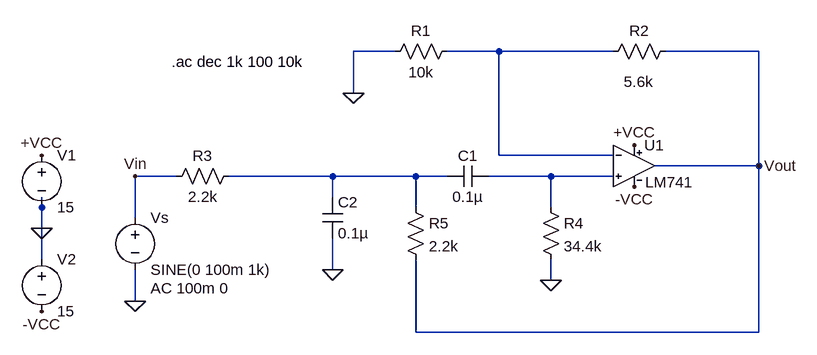
[diagram p0: schematic BandPassFilter.asc]
BandPassFilter.asc, the LTspice schematic file:
Version 4
SHEET 1 880 680
WIRE -144 -32 -208 -32
WIRE 16 -32 -64 -32
WIRE 192 -32 16 -32
WIRE 416 -32 272 -32
WIRE -208 32 -208 -32
WIRE 16 128 16 -32
WIRE 192 128 16 128
WIRE 416 144 416 -32
WIRE 416 144 256 144
WIRE -480 160 -544 160
WIRE -240 160 -400 160
WIRE -112 160 -240 160
WIRE -64 160 -112 160
WIRE 96 160 0 160
WIRE 192 160 96 160
WIRE -240 192 -240 160
WIRE -688 208 -688 192
WIRE -112 208 -112 160
WIRE 96 208 96 160
WIRE -544 224 -544 160
WIRE -688 240 -688 208
WIRE -688 288 -688 240
WIRE -240 304 -240 256
WIRE 96 320 96 288
WIRE -544 352 -544 304
WIRE -112 400 -112 288
WIRE 416 400 416 144
WIRE 416 400 -112 400
FLAG -208 32 0
FLAG 224 112 +VCC
FLAG 224 176 -VCC
FLAG -240 304 0
FLAG -544 352 0
FLAG 96 320 0
FLAG 416 144 Vout
FLAG -688 128 +VCC
FLAG -688 368 -VCC
FLAG -688 240 0
FLAG -544 160 Vin
SYMBOL LM741 224 80 R0
SYMATTR InstName U1
SYMBOL cap 0 144 R90
WINDOW 0 0 32 VBottom 2
WINDOW 3 32 32 VTop 2
SYMATTR InstName C1
SYMATTR Value 0.1µ
SYMBOL res -48 -48 R90
WINDOW 0 0 56 VBottom 2
WINDOW 3 32 56 VTop 2
SYMATTR InstName R1
SYMATTR Value 10k
SYMBOL res 288 -48 R90
WINDOW 0 0 56 VBottom 2
WINDOW 3 47 57 VTop 2
SYMATTR InstName R2
SYMATTR Value 5.6k
SYMBOL cap -256 192 R0
SYMATTR InstName C2
SYMATTR Value 0.1µ
SYMBOL res -384 144 R90
WINDOW 0 0 56 VBottom 2
WINDOW 3 32 56 VTop 2
SYMATTR InstName R3
SYMATTR Value 2.2k
SYMBOL voltage -544 208 R0
WINDOW 123 24 124 Left 2
WINDOW 39 0 0 Left 0
SYMATTR Value2 AC 100m 0
SYMATTR InstName Vs
SYMATTR Value SINE(0 100m 1k)
SYMBOL res 80 192 R0
WINDOW 0 36 40 Left 2
WINDOW 3 36 76 Left 2
SYMATTR InstName R4
SYMATTR Value 34.4k
SYMBOL res -128 192 R0
WINDOW 0 36 40 Left 2
WINDOW 3 36 76 Left 2
SYMATTR InstName R5
SYMATTR Value 2.2k
SYMBOL voltage -688 272 R0
WINDOW 123 0 0 Left 0
WINDOW 39 0 0 Left 0
SYMATTR InstName V2
SYMATTR Value 15
SYMBOL voltage -688 112 R0
WINDOW 123 0 0 Left 0
WINDOW 39 0 0 Left 0
SYMATTR InstName V1
SYMATTR Value 15
TEXT -488 -16 Left 2 !.ac dec 1k 100 10k

The netlist it stands for:
* BandPassFilter.asc
XU1 N003 N001 +VCC -VCC Vout LM741  ; pins In+ In- V+ V- OUT
C1 N003 N002 0.1µ
R1 N001 0 10k
R2 Vout N001 5.6k
C2 N002 0 0.1µ
R3 N002 Vin 2.2k
Vs Vin 0 SINE(0 100m 1k) AC 100m 0
R4 N003 0 34.4k
R5 N002 Vout 2.2k
V2 0 -VCC 15
V1 +VCC 0 15
.ac dec 1k 100 10k
.lib LM741.lib
.backanno
.end